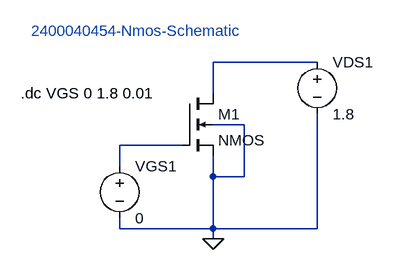
[diagram p0: schematic Nmos threshold voltage.asc]
Nmos threshold voltage.asc, the LTspice schematic file:
Version 4.1
SHEET 1 880 680
WIRE 448 64 288 64
WIRE 288 112 288 64
WIRE 336 160 288 160
WIRE 240 192 144 192
WIRE 144 224 144 192
WIRE 288 240 288 208
WIRE 336 240 336 160
WIRE 336 240 288 240
WIRE 144 320 144 304
WIRE 288 320 288 240
WIRE 288 320 144 320
WIRE 448 320 448 144
WIRE 448 320 288 320
WIRE 288 336 288 320
FLAG 288 336 0
SYMBOL nmos4 240 112 R0
SYMATTR InstName M1
SYMBOL voltage 144 208 R0
WINDOW 123 0 0 Left 0
WINDOW 39 0 0 Left 0
SYMATTR InstName VGS1
SYMATTR Value 0
SYMBOL voltage 448 48 R0
SYMATTR InstName VDS1
SYMATTR Value 1.8
TEXT -8 112 Left 2 !.dc VGS 0 1.8 0.01
TEXT 8 16 Left 2 ;2400040454-Nmos-Schematic

The netlist it stands for:
* Nmos threshold voltage.asc
M1 N001 N002 0 0 NMOS
VGS1 N002 0 0
VDS1 N001 0 1.8
.model NMOS NMOS
.model PMOS PMOS
.lib standard.mos
.dc VGS 0 1.8 0.01
* 2400040454-Nmos-Schematic
.backanno
.end